# Altium project PH_SPI_Implement.PrjPcb
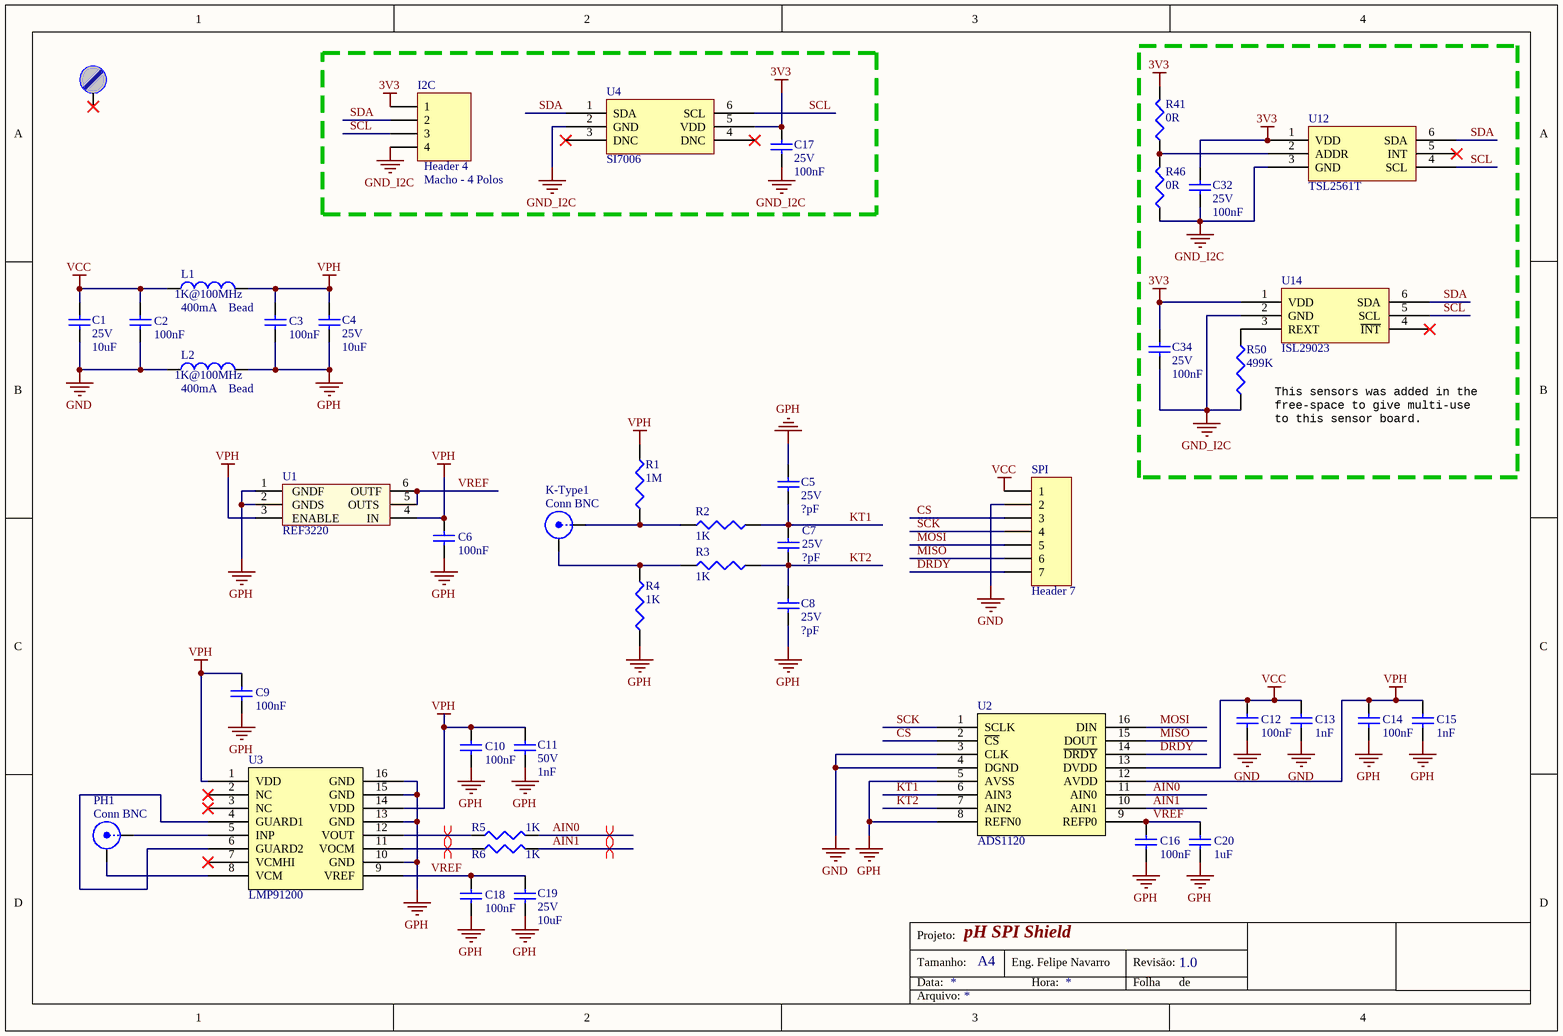
[diagram p0: PH.SchDoc]
1 sheet, 44 parts. Net scope: global (net labels, ports and power ports of the same name join across sheets).
Board file: PH.PcbDoc

## Sheet PH.SchDoc: pH SPI Shield
size A4; Revision: 1.0

### Parts
C1  value 10uF  Tensão: 25V  [CC0805]  (hidden comment: Capacitor Cerâmico)
C2  value 100nF  [CC0603]  (hidden comment: Capacitor Cerâmico)
C3  value 100nF  [CC0603]  (hidden comment: Capacitor Cerâmico)
C4  value 10uF  Tensão: 25V  [CC0805]  (hidden comment: Capacitor Cerâmico)
C5  value ?pF  Tensão: 25V  [CC0603]  (hidden comment: Capacitor Cerâmico)
C6  value 100nF  [CC0603]  (hidden comment: Capacitor Cerâmico)
C7  value ?pF  Tensão: 25V  [CC0603]  (hidden comment: Capacitor Cerâmico)
C8  value ?pF  Tensão: 25V  [CC0603]  (hidden comment: Capacitor Cerâmico)
C9  value 100nF  [CC0603]  (hidden comment: Capacitor Cerâmico)
C10  value 100nF  [CC0603]  (hidden comment: Capacitor Cerâmico)
C11  value 1nF  Tensão: 50V  [CC0603]  (hidden comment: Capacitor Cerâmico)
C12  value 100nF  [CC0603]  (hidden comment: Capacitor Cerâmico)
C13  value 1nF  [CC0603]  (hidden comment: Capacitor Cerâmico)
C14  value 100nF  [CC0603]  (hidden comment: Capacitor Cerâmico)
C15  value 1nF  [CC0603]  (hidden comment: Capacitor Cerâmico)
C16  value 100nF  [CC0603]  (hidden comment: Capacitor Cerâmico)
C17  value 100nF  Tensão: 25V  [CC0603]  (hidden comment: Capacitor Cerâmico)
C18  value 100nF  [CC0603]  (hidden comment: Capacitor Cerâmico)
C19  value 10uF  Tensão: 25V  [CC0805]  (hidden comment: Capacitor Cerâmico)
C20  value 1uF  [CC0603]  (hidden comment: Capacitor Cerâmico)
C32  value 100nF  Tensão: 25V  [CC0603]  (hidden comment: Capacitor Cerâmico)
C34  value 100nF  Tensão: 25V  [CC0603]  (hidden comment: Capacitor Cerâmico)
I2C  Header 4  value Macho - 4 Polos  [CONN HDR1X4]
K-Type1  Conn BNC  [CONN BNC-JACK]
L1  Bead  value 1K@100MHz  Corrente: 400mA  [CC0603]
L2  Bead  value 1K@100MHz  Corrente: 400mA  [CC0603]
M2  Furo de Fixação  [Furo_M3]  (value not drawn)  (no BOM)
PH1  Conn BNC  [CONN BNC-JACK]
R1  value 1M  [CC0603]  (hidden comment: Resistor)
R2  value 1K  [CC0603]  (hidden comment: Resistor)
R3  value 1K  [CC0603]  (hidden comment: Resistor)
R4  value 1K  [CC0603]  (hidden comment: Resistor)
R5  value 1K  [CC0603]  (hidden comment: Resistor)
R6  value 1K  [CC0603]  (hidden comment: Resistor)
R41  value 0R  [CC0603]  (hidden comment: Resistor)
R46  value 0R  [CC0603]  (hidden comment: Resistor)
R50  value 499K  [CC0603]  (hidden comment: Resistor)
SPI  Header 7  [CONN HDR1X7]
U1  REF3220  [SOT-23-6N]
U2  ADS1120  [TSSOP-16N]
U3  LMP91200  [TSSOP-16N]
U4  SI7006  [QFN3x3-6P]
U12  TSL2561T  [TSL2561-TMB6]
U14  ISL29023  [QFN2x2-6]

### Nets
3V3: C17.2 C32.2 C34.2 I2C.1 R41.2 U4.5(VDD) U12.1(VDD) U14.1(VDD)
GND: C1.1 C2.1 C12.1 C13.1 L2.1 SPI.2 U2.3(CLK) U2.4(DGND)
GND_I2C: C17.1 C32.1 C34.1 I2C.4 R46.1 R50.1 U4.2(GND) U12.3(GND) U14.2(GND)
GPH: C3.1 C4.1 C5.2 C6.1 C8.1 C9.1 C10.1 C11.1 C14.1 C15.1 C16.1 C18.1 C19.1 C20.1 L2.2 R4.2 U1.1(GNDF) U1.2(GNDS) U2.5(AVSS) U2.8(REFN0) U3.10(GND) U3.13(GND) U3.15(GND) U3.16(GND)
VCC: C1.2 C2.2 C12.2 C13.2 L1.1 SPI.1 U2.13(DVDD)
VPH: C3.2 C4.2 C6.2 C9.2 C10.2 C11.2 C14.2 C15.2 L1.2 R1.2 U1.3(ENABLE) U1.4(IN) U2.12(AVDD) U3.1(VDD) U3.14(VDD)
AIN0: R5.2 U2.11(AIN0)
AIN1: R6.2 U2.10(AIN1)
CS: SPI.3 U2.2(~{CS})
DRDY: SPI.7 U2.14(~{DRDY})
KT1: C5.1 C7.2 R2.1 U2.6(AIN3)
KT2: C7.1 C8.2 R3.2 U2.7(AIN2)
MISO: SPI.6 U2.15(DOUT)
MOSI: SPI.5 U2.16(DIN)
SCK: SPI.4 U2.1(SCLK)
SCL: I2C.3 U4.6(SCL) U12.4(SCL) U14.5(SCL)
SDA: I2C.2 U4.1(SDA) U12.6(SDA) U14.6(SDA)
VREF: C16.2 C18.2 C19.2 C20.2 U1.5(OUTS) U1.6(OUTF) U2.9(REFP0) U3.9(VREF)
NetK-Type1_1: K-Type1.1(X) R1.1 R2.2
NetK-Type1_2: K-Type1.2(Y) R3.1 R4.1
NetPH1_1: PH1.1(X) U3.5(INP)
NetPH1_2: PH1.2(Y) U3.8(VCM)
NetR5_1: R5.1 U3.12(VOUT)
NetR6_1: R6.1 U3.11(VOCM)
NetR41_1: R41.1 R46.2 U12.2(ADDR)
NetR50_2: R50.2 U14.3(REXT)
NetU3_4: U3.4(GUARD1) U3.6(GUARD2)

Not connected (* = marked no-connect by the designer): M2 X*; U3 2(NC)* 3(NC)* 7(VCMHI)*; U4 3(DNC)* 4(DNC)*; U12 5(INT)*; U14 4(~{INT})*

### Layout directives
differential pair: AIN0, AIN1, NetR5_1, NetR6_1

### Notes on the sheet
- This sensors was added in the free-space to give multi-use to this sensor board.
- Projeto:
- Tamanho:
- Data:
- A4
- Eng. Felipe Navarro
- Hora:
- Revisão:
- Folha
- de
- Arquivo:

### Library data of the parts
C1 C4 C19 = Cap 10uF 25V 0805 X5R: Capacitor (Semiconductor SIM Model); Chinês: Local; ChinesePrice: 0,02620; Corrente: *A; Potência: *W; Obs:: X5R; Tolerância: ±10%; Supplier 1: Digi-Key; Supplier Part Number 1: 587-2985-1-ND; ComponentLink1Description: Datasheet; ComponentLink1URL: D:\Tecnoclade\Datasheet\!DataMissing.pdf
C2 C3 C6 C9 C10 C12-C18 C20 C32 C34 = Cap 100nF 25V 0603 X7R: Capacitor (Semiconductor SIM Model); Chinês: Local; ChinesePrice: 0,00246; Corrente: *A; Potência: *W; Obs:: X7R; Tolerância: ±10%; Supplier 1: Digi-Key; Supplier Part Number 1: 490-1524-1-ND; ComponentLink1Description: Datasheet; ComponentLink1URL: D:\Tecnoclade\Datasheet\!DataMissing.pdf
C5 C7 C8 = Cap - $Val $V $Footprint $Classe_1: Capacitor (Semiconductor SIM Model); Chinês: ----; ChinesePrice: 0,00000; Corrente: *A; Potência: *W; Tolerância: ±*%; Supplier 1: Digi-Key; Supplier Part Number 1: --Del; Obs:: *; ComponentLink1Description: Datasheet; ComponentLink1URL: D:\Tecnoclade\Datasheet\!DataMissing.pdf
C11 = Cap 1nF 50V 0603 NP0: Capacitor (Semiconductor SIM Model); Chinês: Local; ChinesePrice: 0,00700; Corrente: *A; Potência: *W; Obs:: NP0; Tolerância: ±5%; Supplier 1: Digi-Key; Supplier Part Number 1: 490-1451-1-ND; ComponentLink1Description: Datasheet; ComponentLink1URL: D:\Tecnoclade\Datasheet\!DataMissing.pdf
I2C = Header 4: Header, 4-Pin; ChinesePrice: 0,10000; Chinês: Proved - Local; Obs:: Barra de 40 pinos - ATENÇÃO; Corrente: *; Potência: *; Supplier 1: Digi-Key; Supplier Part Number 1: A26509-40-ND; Tensão: *; Tolerância: *; ComponentLink1Description: Datasheet; ComponentLink1URL: D:\Tecnoclade\Datasheet\!DataMissing.pdf
K-Type1 PH1 = Conn BNC: Conector BNC; ChinesePrice: 0,00000; Chinês: ----; Value: Jack BNC; Corrente: *; Potência: *; Supplier 1: Digi-Key; Supplier Part Number 1: A97569-ND; Tensão: *; Obs:: *; Tolerância: *; ComponentLink1Description: Datasheet; ComponentLink1URL: D:\Tecnoclade\Datasheet\!DataMissing.pdf
L1 L2 = Bd 1K@100MHz 0603 400mA: ChinesePrice: 0,00000; Chinês: -----; Obs:: Ferrite (0R5); Tolerância: ±25%; Potência: *; Supplier 1: Digi-Key; Supplier Part Number 1: 445-1550-1-ND; Tensão: *; ComponentLink1Description: Datasheet; ComponentLink1URL: D:\Tecnoclade\Datasheet\!DataMissing.pdf; Substituição: 27/06/2014
M2 = Parafuso: Furo para parafuso; Value: M3; ChinesePrice: 0,00000; Chinês: ----; Supplier 1: Digi-Key; Supplier Part Number 1: --Del; Corrente: *; Potência: *; Tensão: *; Tolerância: *; Obs:: *; ComponentLink1Description: Datasheet; ComponentLink1URL: D:\Tecnoclade\Datasheet\!DataMissing.pdf
R1-R4 = Res - $Val $% $Footprint $Pot: ChinesePrice: 0,00000; Chinês: ----; Corrente: *A; Potência: 1/10W; Tensão: *V; Tolerância: ±*%; Supplier 1: Digi-Key; Supplier Part Number 1: --Del; Obs:: *; ComponentLink1Description: Datasheet; ComponentLink1URL: D:\Tecnoclade\Datasheet\!DataMissing.pdf
R5 R6 = Res 1K 1% 0603 1/10W: ChinesePrice: 0,00089; Chinês: Local; Corrente: *A; Potência: 1/10W; Tensão: *V; Tolerância: ±1%; Supplier 1: Digi-Key; Supplier Part Number 1: RMCF0603FT1K00CT-ND; Obs: *; ComponentLink1Description: Datasheet; ComponentLink1URL: D:\Tecnoclade\Datasheet\!DataMissing.pdf
R41 R46 = Res 0R 0603 1/10W: ChinesePrice: 0,00089; Chinês: Local; Corrente: *A; Potência: 1/10W; Tensão: *V; Tolerância: Jumper; Supplier 1: Digi-Key; Supplier Part Number 1: P0.0GCT-ND; Obs: *; ComponentLink1Description: Datasheet; ComponentLink1URL: D:\Tecnoclade\Datasheet\!DataMissing.pdf
R50 = Res 499K 1% 0603 1/10W: ChinesePrice: 0,00000; Chinês: ----; Corrente: *A; Potência: 1/10W; Tensão: *V; Tolerância: 1±*%; Supplier 1: Digi-Key; Supplier Part Number 1: 311-499KHRCT-ND; Obs:: *; ComponentLink1Description: Datasheet; ComponentLink1URL: D:\Tecnoclade\Datasheet\!DataMissing.pdf
SPI = Header 7: Header, 7-Pin; ChinesePrice: 0,10000; Chinês: Proved - Local; Value: Barra de 40 pinos - ATENÇÃO; Corrente: *; Potência: *; Supplier 1: Digi-Key; Supplier Part Number 1: A26509-40-ND; Tensão: *; Obs:: *; Tolerância: *; ComponentLink1Description: Datasheet; ComponentLink1URL: D:\Tecnoclade\Datasheet\!DataMissing.pdf
U1 = REF3220: 2.048v Precision Voltage Reference; Supplier 1: Digi-Key; Supplier Part Number 1: 296-18226-1-ND
U2 = ADS1120IPWR: ADS1120 Low-Power, Low-Noise, 16-Bit ADC for Small-Signal Sensors; ChinesePrice: 0,00000; Chinês: ----; Supplier 1: Digi-Key; Supplier Part Number 1: 296-37280-1-ND; Corrente: *; Potência: *; Tensão: *; Value: *; Obs:: *; Tolerância: *; ComponentLink1Description: Datasheet; ComponentLink1URL: D:\Tecnoclade\Datasheet\
U3 = LMP91200: AFE for Low-Power Chemical-Sensing Applications; ChinesePrice: 0,00000; Chinês: ----; Supplier 1: Digi-Key; Corrente: *; Potência: *; Tensão: *; Value: *; Obs:: *; Tolerância: *; ComponentLink1Description: Datasheet; ComponentLink1URL: D:\Tecnoclade\Datasheet\
U4 = SI7006: SI7021-A20-GM1; ChinesePrice: 0,00000; Chinês: ----; Corrente: *; Potência: *; Tensão: *; Value: *; Supplier 1: Digi-Key; Supplier Part Number 1: 336-3141-ND; Obs:: *; Tolerância: *; ComponentLink1Description: Datasheet; ComponentLink1URL: https://www.silabs.com/Support%20Documents%2FTechnicalDocs%2FSi7006-A20.pdf
U12 = TSL2561T: Lux Meter; ChinesePrice: 0,00000; Chinês: ----; Corrente: *; Potência: *; Tensão: *; Value: *; Supplier 1: Digi-Key; Supplier Part Number 1: TSL2561-TCT-ND; Obs:: *; Tolerância: *; ComponentLink1Description: Datasheet; ComponentLink1URL: https://www.silabs.com/Support%20Documents%2FTechnicalDocs%2FSi7006-A20.pdf
U14 = ISL29023: Lux Meter; ChinesePrice: 0,00000; Chinês: ----; Corrente: *; Potência: *; Tensão: *; Value: *; Supplier 1: Digi-Key; Supplier Part Number 1: ISL29023IROZ-T7CT-ND; Obs:: *; Tolerância: *; ComponentLink1Description: Datasheet; ComponentLink1URL: https://www.silabs.com/Support%20Documents%2FTechnicalDocs%2FSi7006-A20.pdf